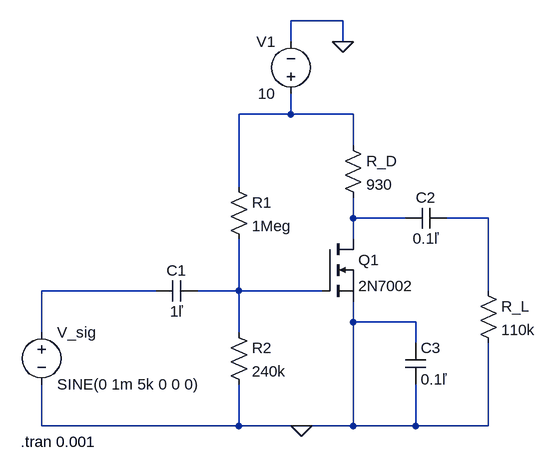
[diagram p0: schematic NNM24EE048_IsaamSheik.asc]
NNM24EE048_IsaamSheik.asc, the LTspice schematic file:
Version 4.1
SHEET 1 880 680
WIRE 176 -160 96 -160
WIRE 96 -128 96 -160
WIRE 176 -128 176 -160
WIRE 96 -16 96 -48
WIRE 96 -16 16 -16
WIRE 192 -16 96 -16
WIRE 192 32 192 -16
WIRE 16 96 16 -16
WIRE 192 144 192 112
WIRE 272 144 192 144
WIRE 400 144 336 144
WIRE 192 176 192 144
WIRE -112 256 -288 256
WIRE 16 256 16 176
WIRE 16 256 -48 256
WIRE 144 256 16 256
WIRE 400 256 400 144
WIRE 192 304 192 272
WIRE 288 304 192 304
WIRE -288 320 -288 256
WIRE 16 320 16 256
WIRE 288 336 288 304
WIRE -288 464 -288 400
WIRE 16 464 16 400
WIRE 16 464 -288 464
WIRE 112 464 16 464
WIRE 192 464 192 304
WIRE 192 464 112 464
WIRE 288 464 288 400
WIRE 288 464 192 464
WIRE 400 464 400 336
WIRE 400 464 288 464
FLAG 112 464 0
FLAG 176 -128 0
SYMBOL nmos 144 176 R0
SYMATTR InstName Q1
SYMATTR Value 2N7002
SYMBOL res 176 16 R0
SYMATTR InstName R_D
SYMATTR Value 930
SYMBOL cap 272 336 R0
SYMATTR InstName C3
SYMATTR Value 0.1ľ
SYMBOL cap 336 128 R90
WINDOW 0 0 32 VBottom 2
WINDOW 3 32 32 VTop 2
SYMATTR InstName C2
SYMATTR Value 0.1ľ
SYMBOL res 384 240 R0
SYMATTR InstName R_L
SYMATTR Value 110k
SYMBOL res 0 80 R0
SYMATTR InstName R1
SYMATTR Value 1Meg
SYMBOL res 0 304 R0
SYMATTR InstName R2
SYMATTR Value 240k
SYMBOL cap -48 240 R90
WINDOW 0 0 32 VBottom 2
WINDOW 3 32 32 VTop 2
SYMATTR InstName C1
SYMATTR Value 1ľ
SYMBOL voltage -288 304 R0
WINDOW 123 0 0 Left 0
WINDOW 39 0 0 Left 0
SYMATTR InstName V_sig
SYMATTR Value SINE(0 1m 5k 0 0 0)
SYMBOL voltage 96 -32 R180
WINDOW 0 24 96 Left 2
WINDOW 3 24 16 Left 2
WINDOW 123 0 0 Left 0
WINDOW 39 0 0 Left 0
SYMATTR InstName V1
SYMATTR Value 10
TEXT -320 488 Left 2 !.tran 0.001

The netlist it stands for:
* NNM24EE048_IsaamSheik.asc
M§Q1 N002 N005 0 0 2N7002
R_D N001 N002 930
C3 0 0 0.1ľ
C2 N003 N002 0.1ľ
R_L N003 0 110k
R1 N001 N005 1Meg
R2 N005 0 240k
C1 N005 N004 1ľ
V_sig N004 0 SINE(0 1m 5k 0 0 0)
V1 N001 0 10
.model NMOS NMOS
.model PMOS PMOS
.lib standard.mos
.tran 0.001
.backanno
.end